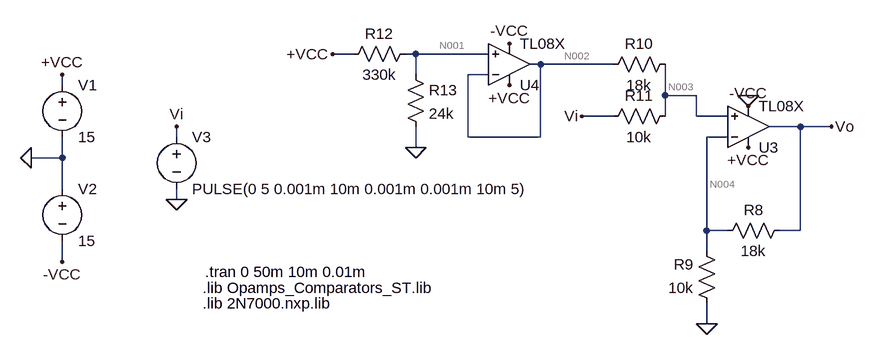
[diagram p0: schematic AcondicionamientoLineal.asc]
AcondicionamientoLineal.asc, the LTspice schematic file:
Version 4
SHEET 1 1860 680
WIRE 640 -144 608 -144
WIRE 736 -144 720 -144
WIRE 848 -144 736 -144
WIRE 928 -128 912 -128
WIRE 1040 -128 928 -128
WIRE 736 -112 736 -144
WIRE 848 -112 816 -112
WIRE 192 -96 192 -112
WIRE 1120 -80 1120 -128
WIRE 1168 -80 1120 -80
WIRE 1040 -48 992 -48
WIRE 1120 -48 1120 -80
WIRE 1168 -48 1168 -80
WIRE 1216 -48 1168 -48
WIRE 1328 -32 1280 -32
WIRE 1376 -32 1328 -32
WIRE 368 -16 368 -32
WIRE 816 -16 816 -112
WIRE 928 -16 928 -128
WIRE 928 -16 816 -16
WIRE 1216 -16 1184 -16
WIRE 736 0 736 -32
WIRE 192 16 192 -16
WIRE 192 16 144 16
WIRE 192 64 192 16
WIRE 368 80 368 64
WIRE 1184 128 1184 -16
WIRE 1216 128 1184 128
WIRE 1328 128 1328 -32
WIRE 1328 128 1296 128
WIRE 1184 160 1184 128
WIRE 192 176 192 144
WIRE 1184 272 1184 240
FLAG 192 -112 +VCC
FLAG 192 176 -VCC
FLAG 368 80 0
FLAG 368 -32 Vi
FLAG 1248 -64 -VCC
FLAG 1184 272 0
FLAG 880 -160 -VCC
FLAG 992 -48 Vi
FLAG 736 0 0
FLAG 608 -144 +VCC
FLAG 1376 -32 Vo
FLAG 880 -96 +VCC
FLAG 1248 0 +VCC
FLAG 144 16 0
FLAG 1248 -80 0
SYMBOL voltage 192 -112 R0
WINDOW 123 0 0 Left 0
WINDOW 39 0 0 Left 0
SYMATTR InstName V1
SYMATTR Value 15
SYMBOL voltage 192 48 R0
WINDOW 123 0 0 Left 0
WINDOW 39 0 0 Left 0
SYMATTR InstName V2
SYMATTR Value 15
SYMBOL voltage 368 -32 R0
WINDOW 123 0 0 Left 0
WINDOW 39 0 0 Left 0
SYMATTR InstName V3
SYMATTR Value PULSE(0 5 0.001m 10m 0.001m 0.001m 10m 5)
SYMBOL res 1312 112 R90
WINDOW 0 0 56 VBottom 2
WINDOW 3 32 56 VTop 2
SYMATTR InstName R8
SYMATTR Value 18k
SYMBOL res 1200 256 R180
WINDOW 0 36 76 Left 2
WINDOW 3 36 40 Left 2
SYMATTR InstName R9
SYMATTR Value 10k
SYMBOL Opamps\\opamp2 1248 32 M180
SYMATTR InstName U3
SYMATTR Value TL08X
SYMBOL res 1136 -144 R90
WINDOW 0 0 56 VBottom 2
WINDOW 3 32 56 VTop 2
SYMATTR InstName R10
SYMATTR Value 18k
SYMBOL res 1136 -64 R90
WINDOW 0 0 56 VBottom 2
WINDOW 3 32 56 VTop 2
SYMATTR InstName R11
SYMATTR Value 10k
SYMBOL Opamps\\opamp2 880 -64 M180
SYMATTR InstName U4
SYMATTR Value TL08X
SYMBOL res 624 -128 R270
WINDOW 0 32 56 VTop 2
WINDOW 3 0 56 VBottom 2
SYMATTR InstName R12
SYMATTR Value 330k
SYMBOL res 720 -128 R0
SYMATTR InstName R13
SYMATTR Value 24k
TEXT 412 192 Left 2 !.tran 0 50m 10m 0.01m
TEXT 408 216 Left 2 !.lib Opamps_Comparators_ST.lib
TEXT 408 240 Left 2 !.lib 2N7000.nxp.lib

The netlist it stands for:
* AcondicionamientoLineal.asc
V1 +VCC 0 15
V2 0 -VCC 15
V3 Vi 0 PULSE(0 5 0.001m 10m 0.001m 0.001m 10m 5)
R8 Vo N004 18k
R9 0 N004 10k
XU3 N003 N004 +VCC -VCC Vo TL08X  ; pins In+ In- V+ V- OUT
R10 N003 N002 18k
R11 N003 Vi 10k
XU4 N001 N002 +VCC -VCC N002 TL08X  ; pins In+ In- V+ V- OUT
R12 +VCC N001 330k
R13 N001 0 24k
.tran 0 50m 10m 0.01m
.lib Opamps_Comparators_ST.lib
.lib 2N7000.nxp.lib
.backanno
.end

* Results of the author's LTspice run, read from the files saved beside the schematic
* Operating Point, zero values left out:
*   V(+vcc) = 15 V
*   V(-vcc) = -15 V
*   V(vo) = 1.017 V
*   V(n004) = 363.2 mV
*   V(n003) = 363.2 mV
*   V(n002) = 1.017 V
*   V(n001) = 1.017 V
*   I(R13) = 42.37 µA
*   I(R12) = 42.37 µA
*   I(R11) = 36.32 µA
*   I(R10) = -36.32 µA
*   I(R9) = -36.32 µA
*   I(R8) = 36.32 µA
*   I(V3) = 36.32 µA
*   I(V2) = -2.757 mA
*   I(V1) = -2.872 mA
*   Ix(u3:4) = 1.415 mA
*   Ix(u3:5) = -1.379 mA
*   Ix(u3:3) = -36.32 µA
*   Ix(u4:4) = 1.415 mA
*   Ix(u4:5) = -1.379 mA
*   Ix(u4:3) = -36.32 µA
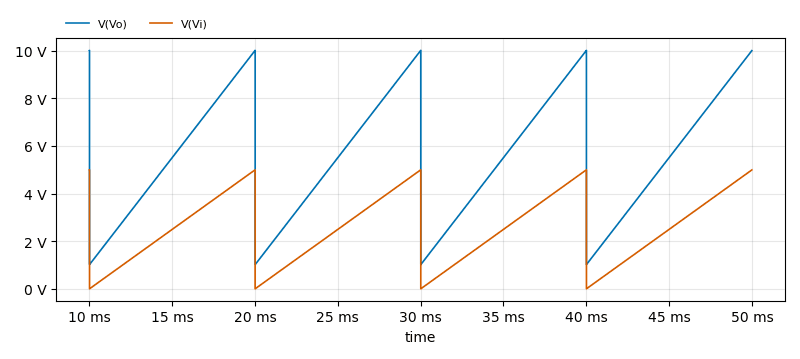
[diagram p1: Transient Analysis of AcondicionamientoLineal.asc, plotted from the saved traces]
* Transient Analysis, 1 run:
*   V(Vo): min 1.018 V, max 10.02 V, average 5.516 V, rms 6.847 V, last 10.01 V
*   V(Vi): min 0 V, max 5 V, average 2.5 V, rms 3.366 V, last 4.996 V